# EAGLE design AirControl (EAGLE 9.6.2)
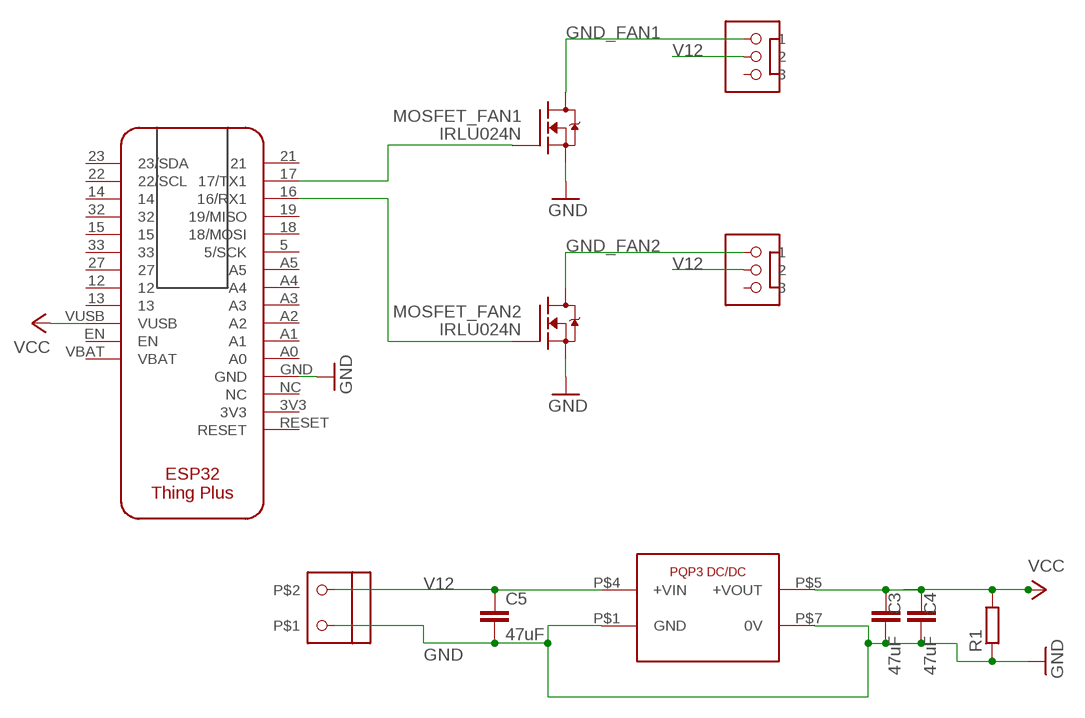
[diagram p0: schematic, sheet 1]

## Parts
C3  47uF  C-EUC1210  [C1210]
C4  47uF  C-EUC1210  [C1210]
C5  47uF  C-EUC1210  [C1210]
MOSFET_FAN1  IRLU024N  [TO220-STANDING]
MOSFET_FAN2  IRLU024N  [TO220-STANDING]
PQP3  PQP3-D12-S5-DPQP3--D12-S5-D  [PQP3-D]
R1  R-EU_R1210  [R1210]
U$2  THING_PLUSTHING_PLUS  [THING_PLUS]
U$3  MOLEX_22-27-2031  [MOLEX_22-27-2031]
U$4  MOLEX_22-27-2031  [MOLEX_22-27-2031]
U$5  AKL012-02  [AKL012-02]

## Nets
GND: C3.2 C4.2 C5.2 MOSFET_FAN1.3(S) MOSFET_FAN2.3(S) PQP3.P$1(GND) PQP3.P$7(0V) R1.1 U$2.GND U$5.P$1
GND_FAN1: MOSFET_FAN1.2(D) U$3.P$1
GND_FAN2: MOSFET_FAN2.2(D) U$4.P$1
N$1: MOSFET_FAN1.1(G) U$2.17(17/TX1)
N$2: MOSFET_FAN2.1(G) U$2.16(16/RX1)
V12: C5.1 PQP3.P$4(+VIN) U$3.P$2 U$4.P$2 U$5.P$2
VCC: C3.1 C4.1 PQP3.P$5(+VOUT) R1.2 U$2.VUSB
Unconnected: U$2.3V3 U$2.5(5/SCK) U$2.12 U$2.13 U$2.14 U$2.15 U$2.18(18/MOSI) U$2.19(19/MISO) U$2.21 U$2.22(22/SCL) U$2.23(23/SDA) U$2.27 U$2.32 U$2.33 U$2.A0 U$2.A1 U$2.A2 U$2.A3 U$2.A4 U$2.A5 U$2.EN U$2.NC U$2.RESET U$2.VBAT U$3.P$3 U$4.P$3

## Library data of the parts
C3-C5 = resistor:C-EU: CAPACITOR, European symbol
MOSFET_FAN1 MOSFET_FAN2 = SonosControl:IRLU024N
PQP3 = AirControl:PQP3-D12-S5-D
R1 = resistor:R-EU_: RESISTOR, European symbol
U$2 = AirControl:THING_PLUS
U$3 U$4 = AirControl:MOLEX_22-27-2031
U$5 = AirControl:AKL012-02

## Board
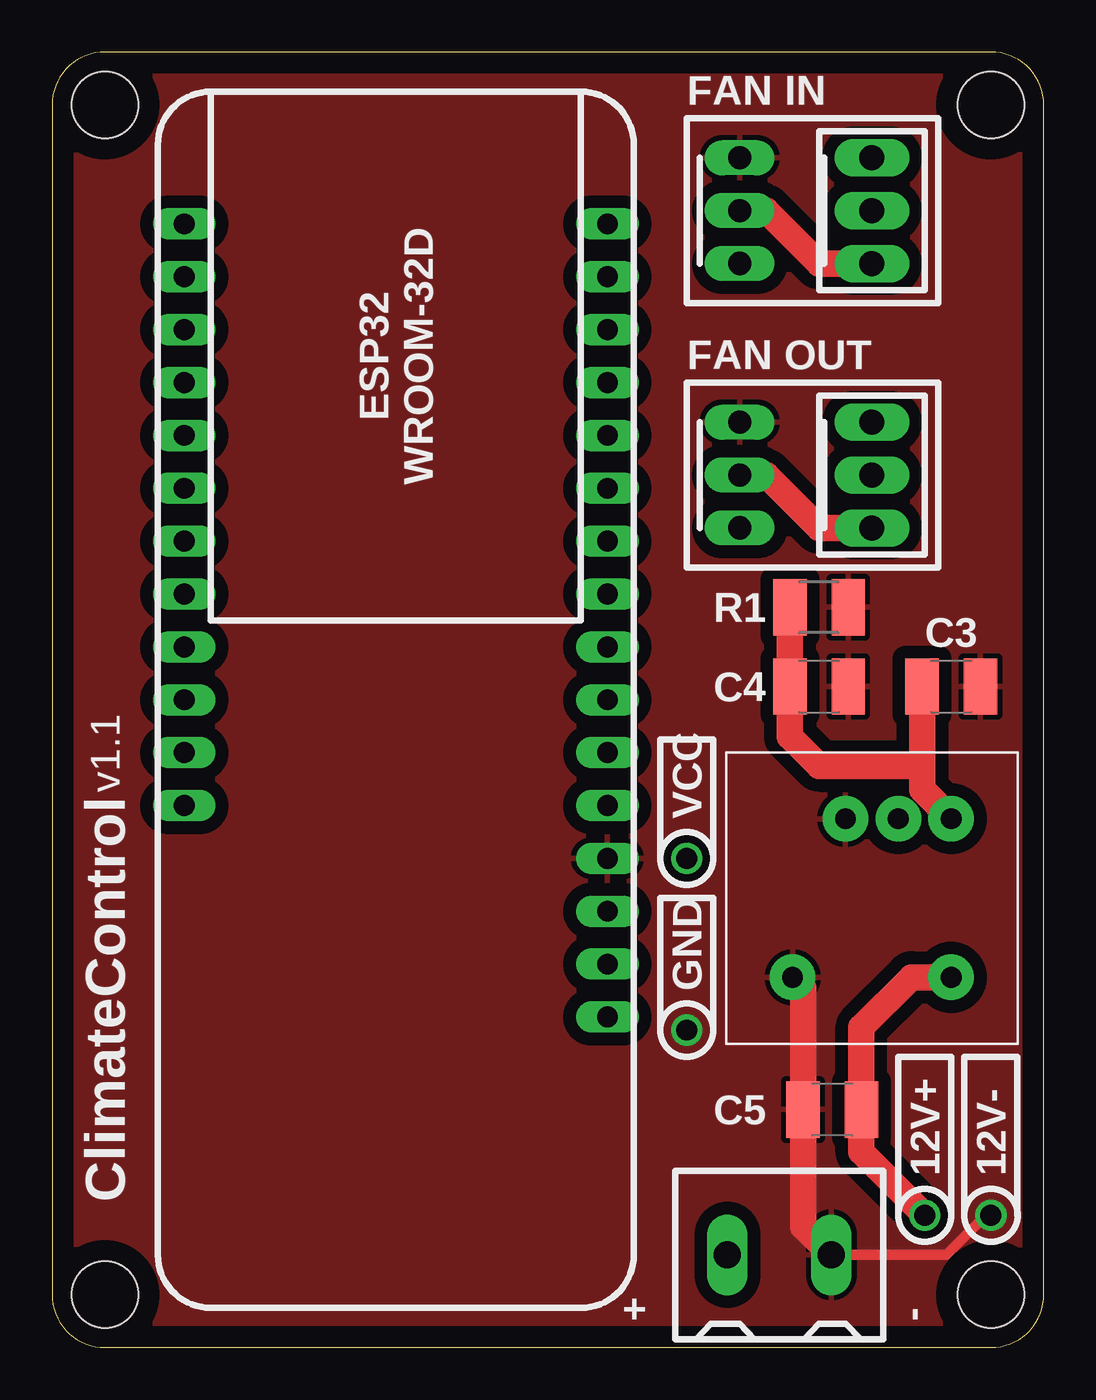
[diagram p1: board, top side]
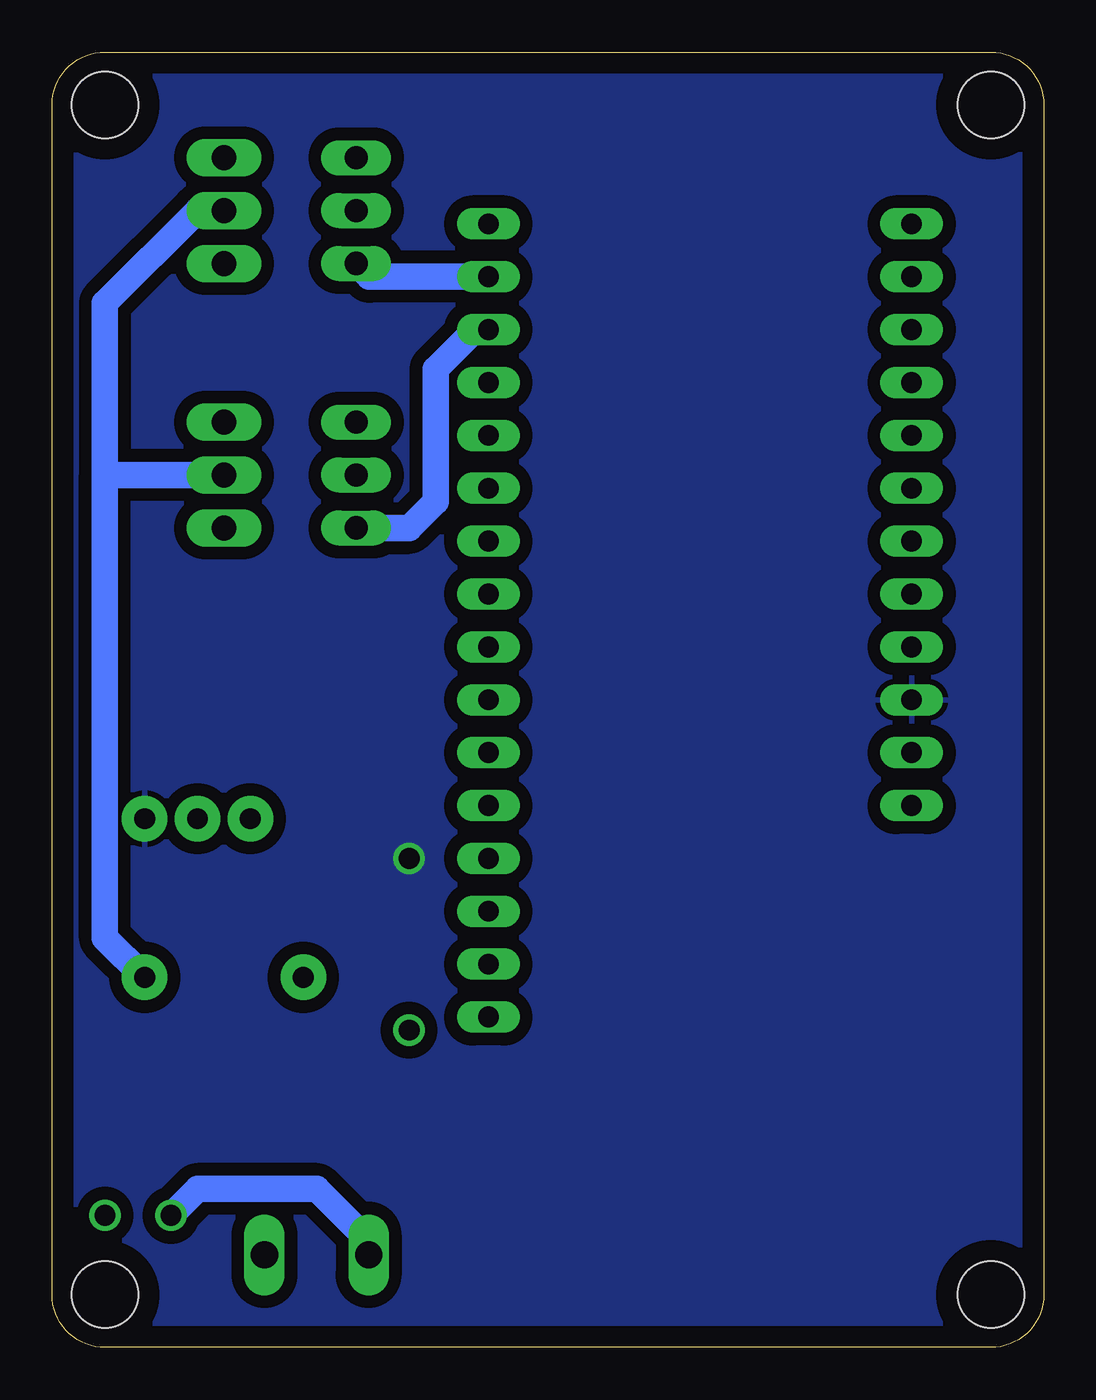
[diagram p2: board, bottom side, seen from below]

Size 47.62 x 62.23 mm. Coordinates in mm from the lower left corner, seen from the top.
Outline: 0,59.69 0,2.54 arc90 2.54,0 45.09,0 arc90 47.62,2.54 47.62,59.69 arc90 45.09,62.23 2.54,62.23 arc90 0,59.69
Copper layers (1*16): Top 0.035mm / dielectric 1.5mm / Bottom 0.035mm
Design rules "default": minimum track width 6mil, minimum drill 0.35mm, track to track 6mil, track to pad 6mil, pad to pad 6mil, via to via 6mil, smd to smd 6mil, copper to edge 40mil, drill to drill 6mil, minimum pad ring 10mil, minimum via ring 8mil, stop-mask expansion 4mil, vias tented up to drill 0mil, thermal gap 10mil
Holes 3.2 mm at 45.09,59.69 2.54,59.69 2.54,2.54 45.09,2.54

### Footprints (pad centres in the part's own frame; a part is rotated, then mirrored left to right if it is on the bottom)
C1210 = smd 1.6 x 2.7: 1 -1.4,0; 2 1.4,0
TO220-STANDING = drill 1.118 long: 1 -2.54,0; 2 0,0; 3 2.54,0
PQP3-D = drill 1 pad 2.184: P$1 -3.81,3.81; P$4 -3.81,-3.81; P$5 3.81,-3.81; P$6 3.81,-1.27; P$7 3.81,1.27
R1210 = smd 1.6 x 2.7: 1 -1.4,0; 2 1.4,0
THING_PLUS = drill 1 long: 3V3 21.59,16.51; 5 21.59,39.37; 12 1.27,34.29; 13 1.27,31.75; 14 1.27,46.99; 15 1.27,41.91; 16 21.59,46.99; 17 21.59,49.53; 18 21.59,41.91; 19 21.59,44.45; 21 21.59,52.07; 22 1.27,49.53; 23 1.27,52.07; 27 1.27,36.83; 32 1.27,44.45; 33 1.27,39.37; A0 21.59,24.13; A1 21.59,26.67; A2 21.59,29.21; A3 21.59,31.75; A4 21.59,34.29; A5 21.59,36.83; EN 1.27,26.67; GND 21.59,21.59; NC 21.59,19.05; RESET 21.59,13.97; VBAT 1.27,24.13; VUSB 1.27,29.21
MOLEX_22-27-2031 = drill 1.194 long: P$1 0,-2.54; P$2 0,0; P$3 0,2.54
AKL012-02 = drill 1.3 long: P$1 0,2.5; P$2 0,-2.5

### Placement (x,y rotation side)
C3  43.18,31.75 0 top
C4  36.83,31.75 0 top
C5  37.47,11.43 180 top
MOSFET_FAN1  33.02,54.61 90 top
MOSFET_FAN2  33.02,41.91 90 top
PQP3  39.37,21.59 90 top
R1  36.83,35.56 180 top
U$2  5.08,1.9 0 top
U$3  39.37,54.61 0 top
U$4  39.37,41.91 0 top
U$5  34.92,4.45 270 top

### Tracks (layer width: path | path; a pad name or v marks a point on that pad's centre or on a via)
GND  (via drill 1)
  Top 0.508: U$5.P$1 42.93,4.45 44.84,6.35 v45.09,6.35
  Top 1.27: PQP3.P$1 36.06,17.28 C5.2 36.06,5.8 U$5.P$1
  other vias: 30.48,15.24
  pour Top (isolate 0.61): 45.09,0 2.54,0 arc-90 0,2.54 0,59.69 arc-90 2.54,62.23 45.09,62.23 arc-90 47.62,59.69 47.62,2.54 arc-90
GND_FAN1
  Top 1.27: MOSFET_FAN1.2 34.29,54.61 36.83,52.07 U$3.P$1
GND_FAN2
  Top 1.27: MOSFET_FAN2.2 34.29,41.91 36.83,39.37 U$4.P$1
N$1
  Bottom 1.27: U$2.17 32.38,51.43 MOSFET_FAN1.1
N$2
  Bottom 1.27: U$2.16 27.3,48.89 29.21,46.99 29.21,40.64 30.48,39.37 MOSFET_FAN2.1
V12  (via drill 1)
  Top 1.27: C5.1 38.73,11.3 | C5.1 38.87,15.37 41.27,17.78 PQP3.P$4 | C5.1 38.87,9.39 v41.91,6.35
  Bottom 1.27: PQP3.P$4 45.09,19.68 45.09,41.91 | U$4.P$2 45.09,41.91 | U$3.P$2 40.64,54.61 45.09,50.16 45.09,41.91 | U$5.P$2 32.42,5.12 34.92,7.62 40.64,7.62 v41.91,6.35
VCC  (via drill 1)
  Top 1.27: C3.1 41.78,27.94 | 41.78,27.94 41.78,26.8 PQP3.P$5 | 35.56,35.69 R1.2 C4.1 35.43,29.34 36.83,27.94 41.78,27.94
  other vias: 30.48,23.5
  pour Bottom (isolate 0.61): 0,59.69 0,2.54 arc90 2.54,0 45.09,0 arc90 47.62,2.54 47.62,59.69 arc90 45.09,62.23 2.54,62.23 arc90

### Text on the board
tPlace: VCC | GND | 12V+ | 12V-
tNames: FAN IN | FAN OUT | v1.1 | ClimateControl | + | -